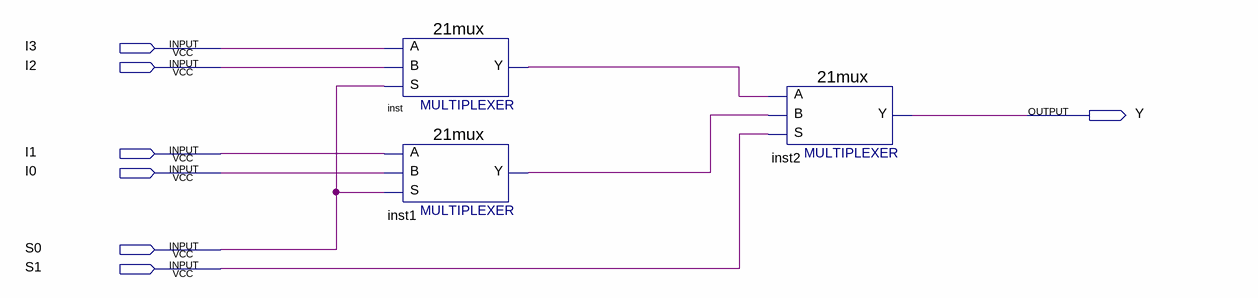
[diagram p0: schematic sheet]
// Quartus schematic Mux4_1.bdf as structural Verilog: 3 symbols, 7 pins
module Mux4_1 (
  input  I3,
  input  I2,
  input  I1,
  input  I0,
  input  S0,
  input  S1,
  output Y
);

  wire inst1_y, inst_y;

  \21mux  inst (.S(S0), .B(I2), .A(I3), .Y(inst_y));
  \21mux  inst1 (.S(S0), .B(I0), .A(I1), .Y(inst1_y));
  \21mux  inst2 (.S(S1), .B(inst1_y), .A(inst_y), .Y(Y));
endmodule
